# EAGLE schematic SparkFunVKeyVoltageKeypad (EAGLE 7.4.0)
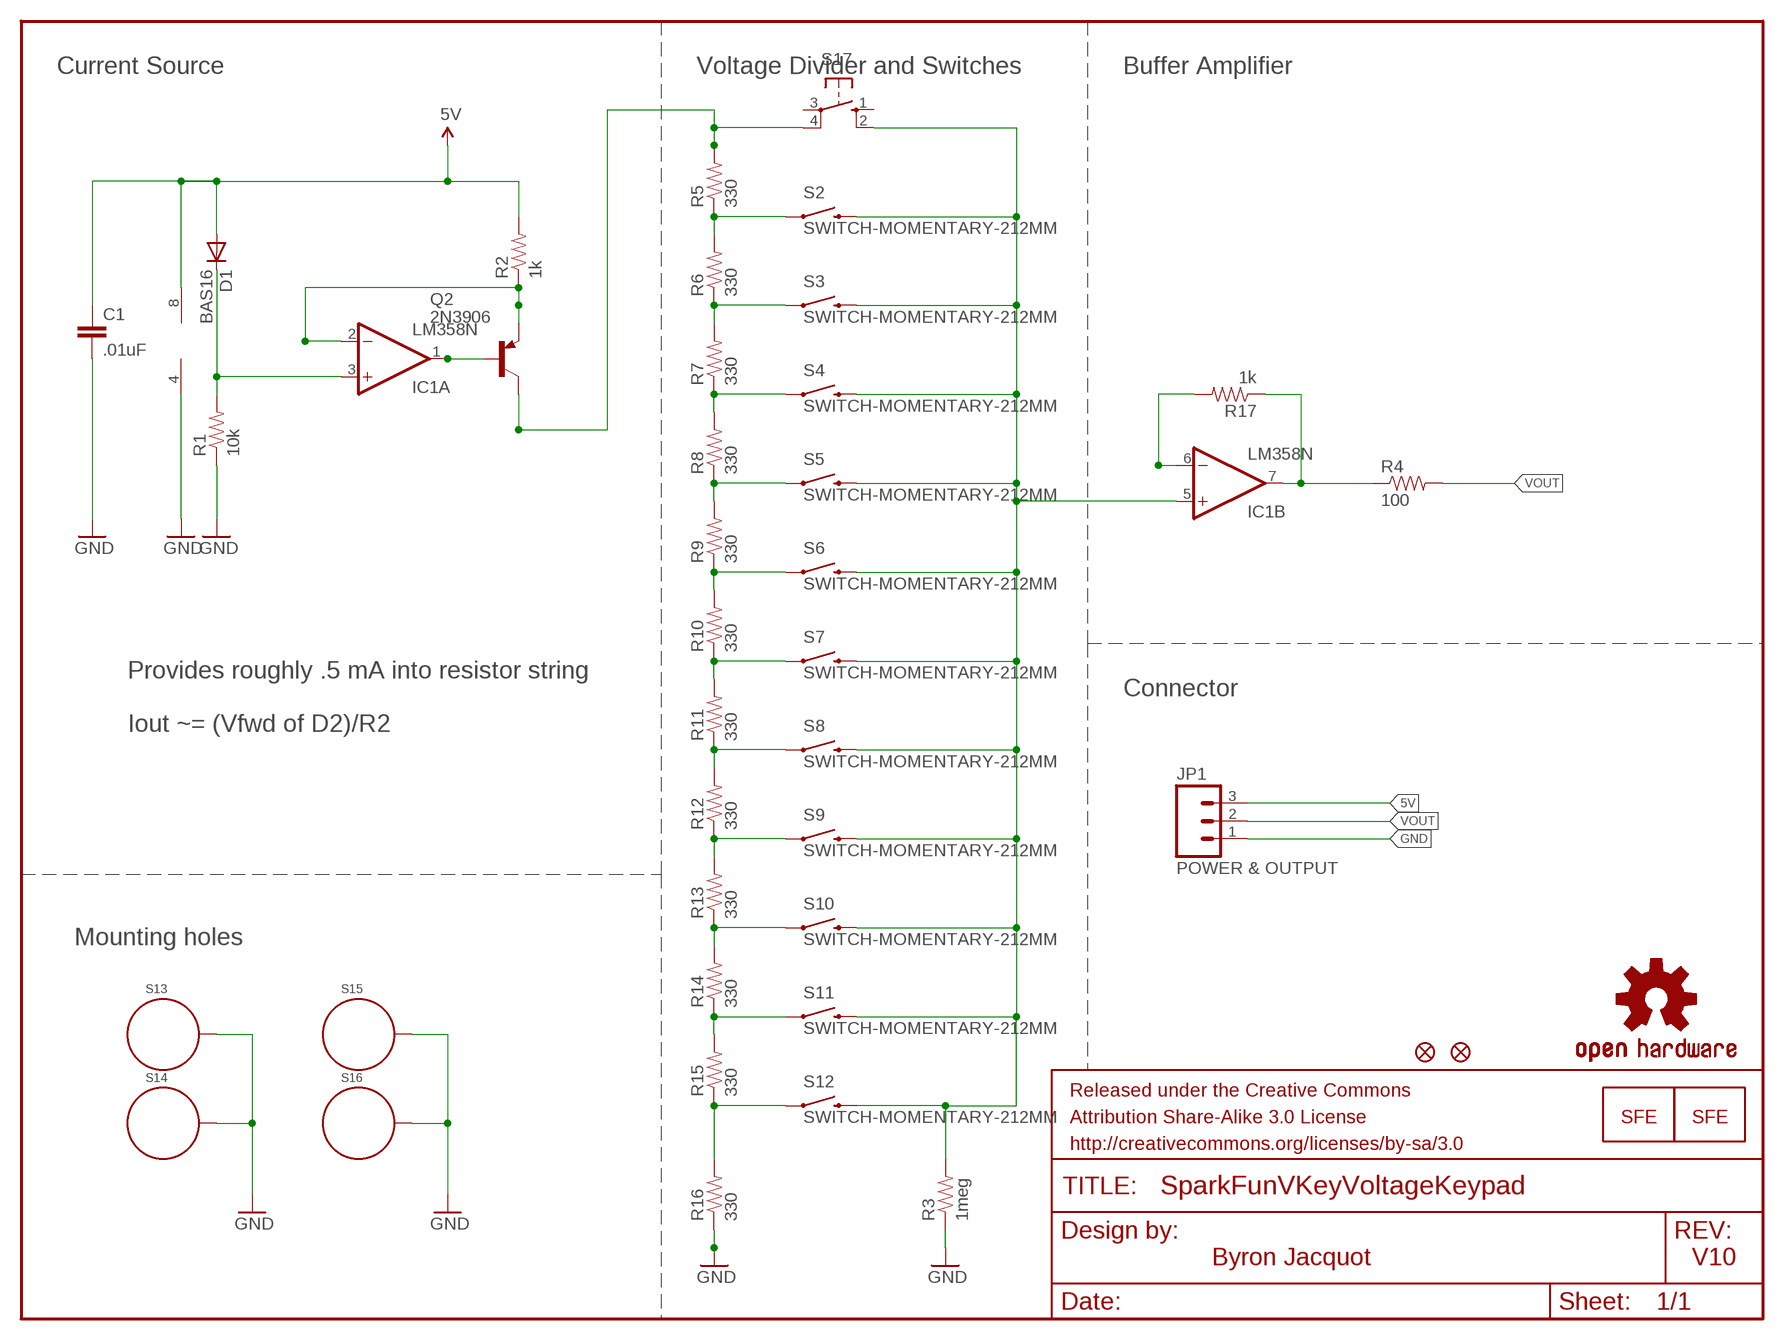
[diagram p0: schematic, sheet 1]

## Parts
C1  .01uF  10NF/10000PF-50V-10%(0603)  [0603-CAP]
D1  BAS16  DIODESOD  [SOD-323]
FID1  FIDUCIALUFIDUCIAL  [MICRO-FIDUCIAL]
FID2  FIDUCIALUFIDUCIAL  [MICRO-FIDUCIAL]
FRAME1  FRAME-LETTER  [CREATIVE_COMMONS]
IC1  LM358N  [DIL08]
JP1  POWER & OUTPUT  M031X03_NO_SILK  [1X03_NO_SILK]
LOGO1  LOGO-SFENEW  [SFE-NEW-WEBLOGO]
LOGO2  LOGO-SFENEW  [SFE-NEW-WEBLOGO]
LOGO3  OSHW-LOGOM  [OSHW-LOGO-M]
LOGO4  OSHW-LOGOL  [OSHW-LOGO-L]
Q2  2N3906  [TO92]
R1  10k  10KOHM1/10W1%(0603)0603  [0603-RES]
R2  1k  1KOHM1/10W1%(0603)  [0603-RES]
R3  1meg  1M-1%  [0603-RES]
R4  100  100OHM1/10W1%(0603)  [0603-RES]
R5  330  330OHM1/10W1%(0603)  [0603-RES]
R6  330  330OHM1/10W1%(0603)  [0603-RES]
R7  330  330OHM1/10W1%(0603)  [0603-RES]
R8  330  330OHM1/10W1%(0603)  [0603-RES]
R9  330  330OHM1/10W1%(0603)  [0603-RES]
R10  330  330OHM1/10W1%(0603)  [0603-RES]
R11  330  330OHM1/10W1%(0603)  [0603-RES]
R12  330  330OHM1/10W1%(0603)  [0603-RES]
R13  330  330OHM1/10W1%(0603)  [0603-RES]
R14  330  330OHM1/10W1%(0603)  [0603-RES]
R15  330  330OHM1/10W1%(0603)  [0603-RES]
R16  330  330OHM1/10W1%(0603)  [0603-RES]
R17  1k  1KOHM1/10W1%(0603)  [0603-RES]
S2  SWITCH-MOMENTARY-212MM  [TACTILE-PTH-12MM]
S3  SWITCH-MOMENTARY-212MM  [TACTILE-PTH-12MM]
S4  SWITCH-MOMENTARY-212MM  [TACTILE-PTH-12MM]
S5  SWITCH-MOMENTARY-212MM  [TACTILE-PTH-12MM]
S6  SWITCH-MOMENTARY-212MM  [TACTILE-PTH-12MM]
S7  SWITCH-MOMENTARY-212MM  [TACTILE-PTH-12MM]
S8  SWITCH-MOMENTARY-212MM  [TACTILE-PTH-12MM]
S9  SWITCH-MOMENTARY-212MM  [TACTILE-PTH-12MM]
S10  SWITCH-MOMENTARY-212MM  [TACTILE-PTH-12MM]
S11  SWITCH-MOMENTARY-212MM  [TACTILE-PTH-12MM]
S12  SWITCH-MOMENTARY-212MM  [TACTILE-PTH-12MM]
S13  STANDOFF_ELECTRICAL  [STANDOFF-ELECTRICAL]
S14  STANDOFF_ELECTRICAL  [STANDOFF-ELECTRICAL]
S15  STANDOFF_ELECTRICAL  [STANDOFF-ELECTRICAL]
S16  STANDOFF_ELECTRICAL  [STANDOFF-ELECTRICAL]
S17  10-XX  [B3F-10XX]

## Nets
5V: C1.1 D1.2(A) IC1.8(P:V+) JP1.3 R2.2
GND: C1.2 IC1.4(P:V-) JP1.1 R1.1 R3.1 R16.1 S13.P1 S14.P1 S15.P1 S16.P1
N$1: D1.1(C) IC1.3(A:+IN) R1.2
N$2: IC1.1(A:OUT) Q2.2(B)
N$3: IC1.5(B:+IN) R3.2 S2.3 S3.3 S4.3 S5.3 S6.3 S7.3 S8.3 S9.3 S10.3 S11.3 S12.3 S17.2(S1)
N$4: R14.1 R15.2 S11.1
N$5: IC1.2(A:-IN) Q2.3(E) R2.1
N$6: Q2.1(C) R5.2 S17.4(P1)
N$7: R5.1 R6.2 S2.1
N$8: R6.1 R7.2 S3.1
N$9: R7.1 R8.2 S4.1
N$10: R8.1 R9.2 S5.1
N$11: R9.1 R10.2 S6.1
N$12: R10.1 R11.2 S7.1
N$13: R11.1 R12.2 S8.1
N$14: R12.1 R13.2 S9.1
N$15: R13.1 R14.2 S10.1
N$16: R15.1 R16.2 S12.1
N$17: IC1.7(B:OUT) R4.1 R17.1
N$18: IC1.6(B:-IN) R17.2
VOUT: JP1.2 R4.2
Unconnected: S17.1(S) S17.3(P)

## Notes on the sheet
- Current Source | Voltage Divider and Switches | Buffer Amplifier
- Provides roughly .5 mA into resistor string
- Connector
- Iout ~= (Vfwd of D2)/R2
- Mounting holes
- Byron Jacquot | V10

## Library data of the parts
C1 = SparkFun-Capacitors:10NF/10000PF-50V-10%(0603): CAP-00867; PROD_ID: CAP-00867; VALUE: 10nF
D1 = SparkFun-DiscreteSemi:DIODE: Diode These are standard reverse protection diodes and small signal diodes. SMA package can handle up to about 1A. SOD-323 can handle about 200mA. What the SOD-323 package when ordering, there are some mfgs out there that are 5-pin packages.; PROD_ID: DIO-09646
FID1 FID2 = SparkFun-Aesthetics:FIDUCIAL: Fiducial Alignment Points Various fiducial points for machine vision alignment.
FRAME1 = SparkFun-Aesthetics:FRAME-LETTER: Schematic Frame Standard 8.5x11 US Letter frame
IC1 = linear:LM358: OP AMP also LM158; LM258; LM2904 Source: http://cache.national.com/ds/LM/LM158.pdf
JP1 = SparkFun-Connectors:M03: Header 3 Standard 3-pin 0.1" header. Use with straight break away headers (SKU : PRT-00116), right angle break away headers (PRT-00553), swiss pins (PRT-00743), machine pins (PRT-00117), and female headers (PRT-00115). Molex polarized connector foot print use with SKU : PRT-08232 with associated crimp pins and housings.
LOGO1 LOGO2 = SparkFun-Aesthetics:LOGO-SFE: Spark Fun Electronics PCB Logo This is the standard Spark Fun Electronics PCB logo.
LOGO3 LOGO4 = SparkFun-Aesthetics:OSHW-LOGO: Open Source Hardware Logo This logo indicates the piece of hardware it is found on incorporates a OSHW license and/or adheres to the definition of open source hardware found here: http://freedomdefined.org/OSHW
Q2 = transistor-pnp:2N3906: PNP Transistor
R1 = SparkFun-Resistors:10KOHM1/10W1%(0603): RES-00824; PROD_ID: RES-00824; VALUE: 10K
R2 R17 = SparkFun-Resistors:1KOHM1/10W1%(0603): RES-07856; PROD_ID: RES-07856; VALUE: 1K
R3 = SparkFun-Resistors:1M-1%: 1M-ohm SMT 1/10W - 1% (0603) RES-07868; PROD_ID: RES-07868; VALUE: 1M
R4 = SparkFun-Resistors:100OHM1/10W1%(0603): RES-07863; PROD_ID: RES-07863
R5-R16 = SparkFun-Resistors:330OHM1/10W1%(0603): RES-00818; PROD_ID: RES-00818
S2-S12 = SparkFun-Electromechanical:SWITCH-MOMENTARY-2: Various NO switches- pushbuttons, reed, etc; PROD_ID: SWCH-09185
S13-S16 = SparkFun-Electromechanical:STANDOFF_ELECTRICAL: A standoff intended to be an electrically connected point. Pad size and stop size allow for a #4 Phillips pan screw head to make a solid connection to the board.
S17 = switch-omron:10-XX: OMRON SWITCH; MPN: B3F-1000; OC_FARNELL: 176432; OC_NEWARK: 36M3542